# Altium schematic sheet LDLN025_1V8_Regulator.SchDoc: LDLN025 +1V8 Fix Voltage Regulator
size A4
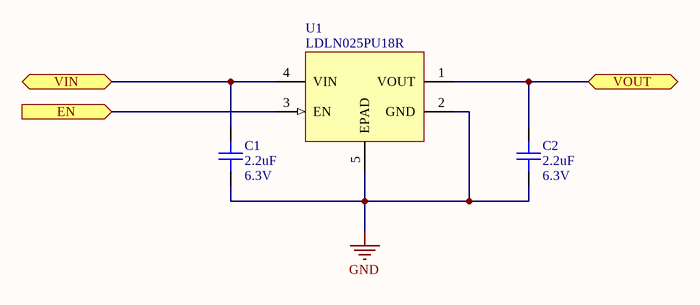
[diagram p0: LDLN025_1V8_Regulator.SchDoc]

## Parts
C1  Capacitance: 2.2uF  Voltage: 6.3V  [C0402]  (hidden comment: CAP CER 2.2UF 6.3V X5R 0402)
C2  Capacitance: 2.2uF  Voltage: 6.3V  [C0402]  (hidden comment: CAP CER 2.2UF 6.3V X5R 0402)
U1  LDLN025PU18R  [DFN65P100X40-4N]

## Ports
EN (in), VIN, VOUT

## Nets
GND: C1.1 C2.1 U1.2(GND) U1.5(EPAD)
EN: U1.3(EN) ; port EN
VIN: C1.2 U1.4(VIN) ; port VIN
VOUT: C2.2 U1.1(VOUT) ; port VOUT

## Notes on the sheet
- Title
- Size:
- Date:
- A4
- Number:
- Time:
- Revision:
- Sheet
- of
- File:

## Library data of the parts
C1 C2 = CAP CER 2.2UF 6.3V X5R 0402: 2.2µF ±20% 6.3V Ceramic Capacitor X5R 0402 (1005 Metric); Manufacturer: Murata; Manufacturer Part Number: GRM155R60J225ME15D; Supplier 1: Digi-Key; Stock 1: 4444410; Pricing 1: 1=0.29, 10=0.199, 100=0.1009, 500=0.0691, 1000=0.0611, 2500=0.0584, 5000=0.0531 (USD); Mount: Surface Mount; Case/Package: 0402; Case Code (Metric): 1005; Case Code (Imperial): 0402; Min Operating Temperature: -55°C; Max Operating Temperature: 85°C; Voltage Rating: 6.3V; Tolerance: 20%; Packaging: Tape and Reel; Package Quantity: 10000; Voltage Rating (DC): 6.3V; Dielectric: X5R; Termination: SMD/SMT; Length: 1mm; Height: 0.5mm; Width: 0.02inch; Thickness: 0.022inch; Depth: 0.5mm; REACH SVHC: No SVHC; Lead Free: Lead Free; ComponentLink1URL: https://www.murata.com/~/media/webrenewal/support/library/catalog/products/capacitor/mlcc/c02e.ashx?la=en-us&src-supplier=Digi-Key; ComponentLink1Description: https://www.murata.com/~/media/webrenewal/support/library/catalog/products/capacitor/mlcc/c02e.ashx?la=en-us&src-supplier=Digi-Key; ComponentLink2URL: http://www.murata.com/~/media/webrenewal/support/library/catalog/products/capacitor/mlcc/c02e.ashx?src-supplier=Avnet; ComponentLink2Description: http://www.murata.com/~/media/webrenewal/support/library/catalog/products/capacitor/mlcc/c02e.ashx?src-supplier=Avnet; ComponentLink3URL: http://www.farnell.com/datasheets/2047859.pdf?src-supplier=Element14; ComponentLink3Description: http://www.farnell.com/datasheets/2047859.pdf?src-supplier=Element14; ComponentLink4URL: https://produktinfo.conrad.com/datenblaetter/450000-474999/450128-da-01-de-VS_KONDENS_GRM155_R60J_225ME15D.pdf?src-supplier=Conrad; ComponentLink4Description: https://produktinfo.conrad.com/datenblaetter/450000-474999/450128-da-01-de-VS_KONDENS_GRM155_R60J_225ME15D.pdf?src-supplier=Conrad; Supplier Part Number 1: 490-4519-1-ND; Material: Ceramic; Radiation Hardening: No
U1 = IC LDLN025 REG LINEAR 1.8V 250MA 4DFN: Linear Voltage Regulator IC 1 Output 250mA 4-DFN (1x1); Manufacturer: STMicroelectronics; Dropout Voltage: 250mV; Number of Regulators: 1; Quiescent Current: 25uA; Output Type: Fixed; Output Configuration: Positive; Max Input Voltage: 5.5V; Min Output Voltage: 1.8V; Max Supply Current: 425uA; Power Supply Rejection Ratio (PSRR): 60dB; Supplier 1: Digi-Key; Manufacturer Part Number: LDLN025PU18R; Stock 1: 4322; Pricing 1: 1=0.61, 10=0.525, 25=0.49, 100=0.364, 250=0.308, 500=0.294, 1000=0.217, 2500=0.203 (USD); Mount: Surface Mount; Min Operating Temperature: -40°C; Max Operating Temperature: 125°C; Packaging: Tape and Reel; Output Current: 250mA; ComponentLink1URL: http://www.st.com/content/ccc/resource/technical/document/datasheet/group3/a7/8d/6a/ac/ed/d0/4f/f4/DM00312779/files/DM00312779.pdf/jcr:content/translations/en.DM00312779.pdf?src-supplier=Digi-Key; ComponentLink1Description: http://www.st.com/content/ccc/resource/technical/document/datasheet/group3/a7/8d/6a/ac/ed/d0/4f/f4/DM00312779/files/DM00312779.pdf/jcr:content/translations/en.DM00312779.pdf?src-supplier=Digi-Key; Supplier Part Number 1: 497-17000-1-ND; Case/Package: DFN